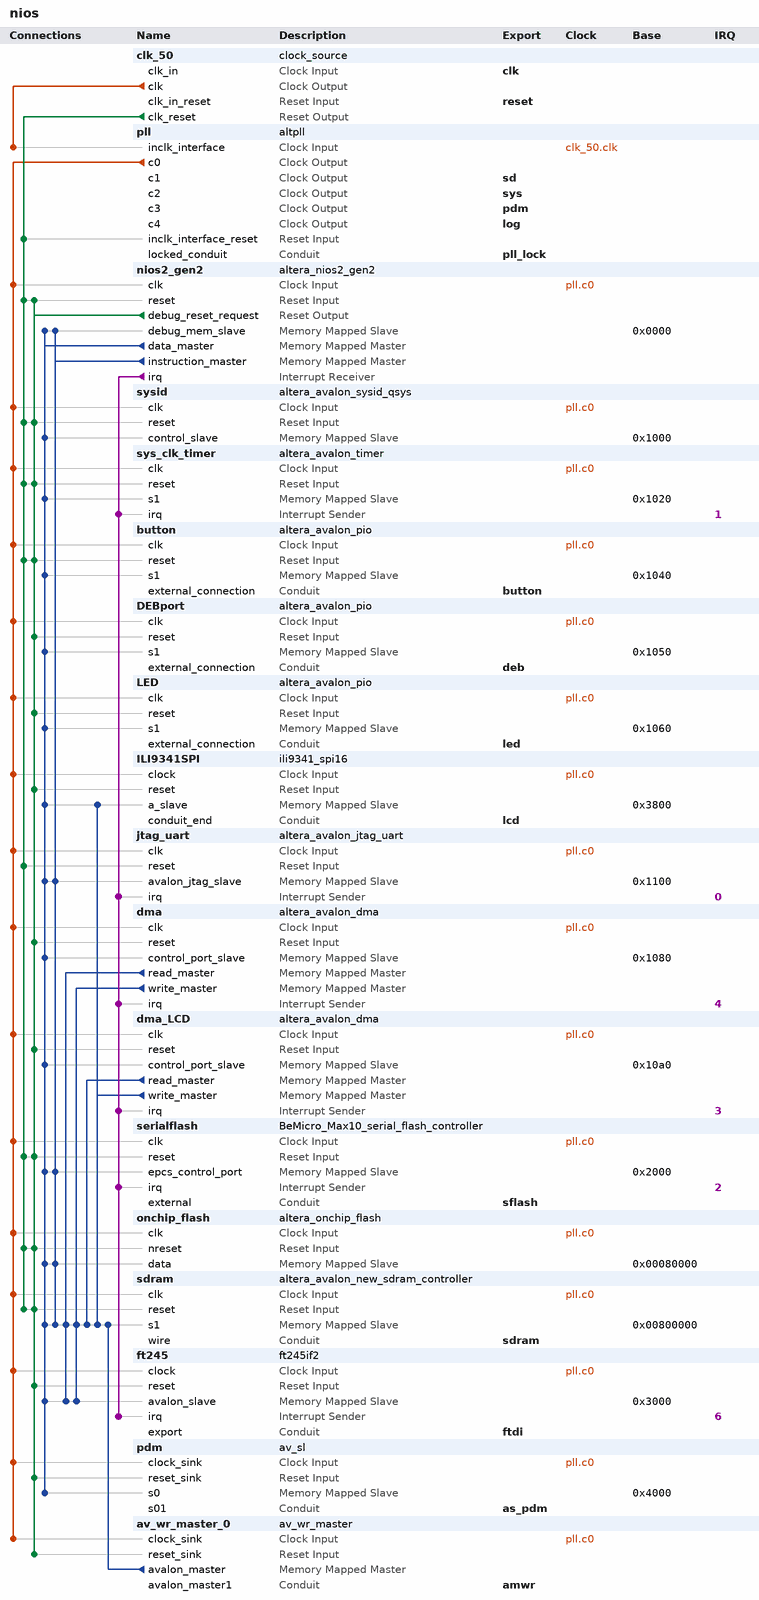
[diagram p0: system contents]
# Platform Designer (Qsys) system nios, MAX 10 10M08DAF484C8GES
# Parameters at their usual value, and those the tool derives, are not listed.
package require -exact qsys 18.1
create_system nios
set_project_property DEVICE_FAMILY {MAX 10}
set_project_property DEVICE 10M08DAF484C8GES

add_instance clk_50 clock_source 18.1
set_instance_parameter_value clk_50 clockFrequency 50000000

add_instance pll altpll 18.1
set_instance_parameter_value pll CLK0_DIVIDE_BY 1
set_instance_parameter_value pll CLK0_MULTIPLY_BY 1
set_instance_parameter_value pll CLK1_DIVIDE_BY 1
set_instance_parameter_value pll CLK1_DUTY_CYCLE 50
set_instance_parameter_value pll CLK1_MULTIPLY_BY 1
set_instance_parameter_value pll CLK1_PHASE_SHIFT -3333
set_instance_parameter_value pll CLK2_DIVIDE_BY 1
set_instance_parameter_value pll CLK2_DUTY_CYCLE 50
set_instance_parameter_value pll CLK2_MULTIPLY_BY 1
set_instance_parameter_value pll CLK2_PHASE_SHIFT 0
set_instance_parameter_value pll CLK3_DIVIDE_BY 3125
set_instance_parameter_value pll CLK3_DUTY_CYCLE 50
set_instance_parameter_value pll CLK3_MULTIPLY_BY 128
set_instance_parameter_value pll CLK3_PHASE_SHIFT 0
set_instance_parameter_value pll CLK4_DIVIDE_BY 50
set_instance_parameter_value pll CLK4_DUTY_CYCLE 50
set_instance_parameter_value pll CLK4_MULTIPLY_BY 1
set_instance_parameter_value pll CLK4_PHASE_SHIFT 0
set_instance_parameter_value pll INCLK0_INPUT_FREQUENCY 20000
set_instance_parameter_value pll PORT_ARESET PORT_UNUSED
set_instance_parameter_value pll PORT_LOCKED PORT_USED
set_instance_parameter_value pll PORT_clk1 PORT_USED
set_instance_parameter_value pll PORT_clk2 PORT_USED
set_instance_parameter_value pll PORT_clk3 PORT_USED
set_instance_parameter_value pll PORT_clk4 PORT_USED

add_instance nios2_gen2 altera_nios2_gen2 18.1
set_instance_parameter_value nios2_gen2 dcache_size 0
set_instance_parameter_value nios2_gen2 exceptionSlave sdram.s1
set_instance_parameter_value nios2_gen2 icache_size 4096
set_instance_parameter_value nios2_gen2 impl Tiny
set_instance_parameter_value nios2_gen2 io_regionsize 32768
set_instance_parameter_value nios2_gen2 resetSlave serialflash.epcs_control_port

add_instance sysid altera_avalon_sysid_qsys 18.1
set_instance_parameter_value sysid id 944587856

add_instance sys_clk_timer altera_avalon_timer 18.1
set_instance_parameter_value sys_clk_timer period 1
set_instance_parameter_value sys_clk_timer periodUnits MSEC

add_instance button altera_avalon_pio 18.1
set_instance_parameter_value button direction Input
set_instance_parameter_value button width 4

add_instance DEBport altera_avalon_pio 18.1
set_instance_parameter_value DEBport direction Output
set_instance_parameter_value DEBport width 8

add_instance LED altera_avalon_pio 18.1
set_instance_parameter_value LED direction Output
set_instance_parameter_value LED width 8

add_instance ILI9341SPI ili9341_spi16 1.0

add_instance jtag_uart altera_avalon_jtag_uart 18.1
set_instance_parameter_value jtag_uart simInteractiveOptions NO_INTERACTIVE_WINDOWS

add_instance dma altera_avalon_dma 18.1
set_instance_parameter_value dma allowByteTransactions true
set_instance_parameter_value dma allowDoubleWordTransactions true
set_instance_parameter_value dma allowHalfWordTransactions true
set_instance_parameter_value dma allowQuadWordTransactions true
set_instance_parameter_value dma burstEnable false
set_instance_parameter_value dma fifoDepth 32
set_instance_parameter_value dma maxBurstSize 128
set_instance_parameter_value dma minimumDmaTransactionRegisterWidth 16

add_instance dma_LCD altera_avalon_dma 18.1
set_instance_parameter_value dma_LCD allowByteTransactions false
set_instance_parameter_value dma_LCD allowDoubleWordTransactions false
set_instance_parameter_value dma_LCD allowHalfWordTransactions true
set_instance_parameter_value dma_LCD allowQuadWordTransactions false
set_instance_parameter_value dma_LCD allowWordTransactions false
set_instance_parameter_value dma_LCD burstEnable false
set_instance_parameter_value dma_LCD fifoDepth 32
set_instance_parameter_value dma_LCD maxBurstSize 128
set_instance_parameter_value dma_LCD minimumDmaTransactionRegisterWidth 18

add_instance serialflash BeMicro_Max10_serial_flash_controller 14.0
set_instance_parameter_value serialflash autoSelectASMIAtom false
set_instance_parameter_value serialflash resetrequest_enabled true
set_instance_parameter_value serialflash useASMIAtom false

add_instance onchip_flash altera_onchip_flash 18.1
set_instance_parameter_value onchip_flash CONFIGURATION_MODE {Single Uncompressed Image with Memory Initialization}
set_instance_parameter_value onchip_flash SECTOR_ACCESS_MODE {Read and write,Read and write,Hidden,Hidden,Hidden}
set_instance_parameter_value onchip_flash initFlashContent false
set_instance_parameter_value onchip_flash initializationFileName altera_onchip_flash.hex
set_instance_parameter_value onchip_flash useNonDefaultInitFile false

add_instance sdram altera_avalon_new_sdram_controller 18.1
set_instance_parameter_value sdram TAC 5.4
set_instance_parameter_value sdram TRCD 15.0
set_instance_parameter_value sdram TRP 15.0
set_instance_parameter_value sdram casLatency 2
set_instance_parameter_value sdram columnWidth 8
set_instance_parameter_value sdram dataWidth 16
set_instance_parameter_value sdram generateSimulationModel false
set_instance_parameter_value sdram model single_Micron_MT48LC4M32B2_7_chip
set_instance_parameter_value sdram numberOfBanks 4
set_instance_parameter_value sdram numberOfChipSelects 1
set_instance_parameter_value sdram powerUpDelay 100.0
set_instance_parameter_value sdram refreshPeriod 15.625
set_instance_parameter_value sdram rowWidth 12

add_instance ft245 ft245if2 1.0

add_instance pdm av_sl 1.0

add_instance av_wr_master_0 av_wr_master 1.0

# connections
add_connection clk_50.clk pll.inclk_interface clock
add_connection pll.c0 av_wr_master_0.clock_sink clock
add_connection pll.c0 button.clk clock
add_connection pll.c0 DEBport.clk clock
add_connection pll.c0 dma.clk clock
add_connection pll.c0 dma_LCD.clk clock
add_connection pll.c0 ft245.clock clock
add_connection pll.c0 ILI9341SPI.clock clock
add_connection pll.c0 jtag_uart.clk clock
add_connection pll.c0 LED.clk clock
add_connection pll.c0 nios2_gen2.clk clock
add_connection pll.c0 onchip_flash.clk clock
add_connection pll.c0 pdm.clock_sink clock
add_connection pll.c0 sdram.clk clock
add_connection pll.c0 serialflash.clk clock
add_connection pll.c0 sys_clk_timer.clk clock
add_connection pll.c0 sysid.clk clock
add_connection clk_50.clk_reset button.reset reset
add_connection clk_50.clk_reset jtag_uart.reset reset
add_connection clk_50.clk_reset nios2_gen2.reset reset
add_connection clk_50.clk_reset onchip_flash.nreset reset
add_connection clk_50.clk_reset pll.inclk_interface_reset reset
add_connection clk_50.clk_reset sdram.reset reset
add_connection clk_50.clk_reset serialflash.reset reset
add_connection clk_50.clk_reset sys_clk_timer.reset reset
add_connection clk_50.clk_reset sysid.reset reset
add_connection nios2_gen2.debug_reset_request av_wr_master_0.reset_sink reset
add_connection nios2_gen2.debug_reset_request button.reset reset
add_connection nios2_gen2.debug_reset_request DEBport.reset reset
add_connection nios2_gen2.debug_reset_request dma.reset reset
add_connection nios2_gen2.debug_reset_request dma_LCD.reset reset
add_connection nios2_gen2.debug_reset_request ft245.reset reset
add_connection nios2_gen2.debug_reset_request ILI9341SPI.reset reset
add_connection nios2_gen2.debug_reset_request LED.reset reset
add_connection nios2_gen2.debug_reset_request nios2_gen2.reset reset
add_connection nios2_gen2.debug_reset_request onchip_flash.nreset reset
add_connection nios2_gen2.debug_reset_request pdm.reset_sink reset
add_connection nios2_gen2.debug_reset_request sdram.reset reset
add_connection nios2_gen2.debug_reset_request serialflash.reset reset
add_connection nios2_gen2.debug_reset_request sys_clk_timer.reset reset
add_connection nios2_gen2.debug_reset_request sysid.reset reset
add_connection av_wr_master_0.avalon_master sdram.s1 avalon
set_connection_parameter_value av_wr_master_0.avalon_master/sdram.s1 baseAddress 0x00800000
add_connection dma.read_master ft245.avalon_slave avalon
set_connection_parameter_value dma.read_master/ft245.avalon_slave baseAddress 0x3000
add_connection dma.read_master sdram.s1 avalon
set_connection_parameter_value dma.read_master/sdram.s1 baseAddress 0x00800000
add_connection dma.write_master ft245.avalon_slave avalon
set_connection_parameter_value dma.write_master/ft245.avalon_slave baseAddress 0x3000
add_connection dma.write_master sdram.s1 avalon
set_connection_parameter_value dma.write_master/sdram.s1 baseAddress 0x00800000
add_connection dma_LCD.read_master sdram.s1 avalon
set_connection_parameter_value dma_LCD.read_master/sdram.s1 baseAddress 0x00800000
add_connection dma_LCD.write_master ILI9341SPI.a_slave avalon
set_connection_parameter_value dma_LCD.write_master/ILI9341SPI.a_slave baseAddress 0x3800
add_connection dma_LCD.write_master sdram.s1 avalon
set_connection_parameter_value dma_LCD.write_master/sdram.s1 baseAddress 0x00800000
add_connection nios2_gen2.data_master button.s1 avalon
set_connection_parameter_value nios2_gen2.data_master/button.s1 baseAddress 0x1040
add_connection nios2_gen2.data_master DEBport.s1 avalon
set_connection_parameter_value nios2_gen2.data_master/DEBport.s1 baseAddress 0x1050
add_connection nios2_gen2.data_master dma.control_port_slave avalon
set_connection_parameter_value nios2_gen2.data_master/dma.control_port_slave baseAddress 0x1080
add_connection nios2_gen2.data_master dma_LCD.control_port_slave avalon
set_connection_parameter_value nios2_gen2.data_master/dma_LCD.control_port_slave baseAddress 0x10a0
add_connection nios2_gen2.data_master ft245.avalon_slave avalon
set_connection_parameter_value nios2_gen2.data_master/ft245.avalon_slave baseAddress 0x3000
add_connection nios2_gen2.data_master ILI9341SPI.a_slave avalon
set_connection_parameter_value nios2_gen2.data_master/ILI9341SPI.a_slave baseAddress 0x3800
add_connection nios2_gen2.data_master jtag_uart.avalon_jtag_slave avalon
set_connection_parameter_value nios2_gen2.data_master/jtag_uart.avalon_jtag_slave baseAddress 0x1100
add_connection nios2_gen2.data_master LED.s1 avalon
set_connection_parameter_value nios2_gen2.data_master/LED.s1 baseAddress 0x1060
add_connection nios2_gen2.data_master nios2_gen2.debug_mem_slave avalon
set_connection_parameter_value nios2_gen2.data_master/nios2_gen2.debug_mem_slave baseAddress 0x0000
add_connection nios2_gen2.data_master onchip_flash.data avalon
set_connection_parameter_value nios2_gen2.data_master/onchip_flash.data baseAddress 0x00080000
add_connection nios2_gen2.data_master pdm.s0 avalon
set_connection_parameter_value nios2_gen2.data_master/pdm.s0 baseAddress 0x4000
add_connection nios2_gen2.data_master sdram.s1 avalon
set_connection_parameter_value nios2_gen2.data_master/sdram.s1 baseAddress 0x00800000
add_connection nios2_gen2.data_master serialflash.epcs_control_port avalon
set_connection_parameter_value nios2_gen2.data_master/serialflash.epcs_control_port baseAddress 0x2000
add_connection nios2_gen2.data_master sys_clk_timer.s1 avalon
set_connection_parameter_value nios2_gen2.data_master/sys_clk_timer.s1 baseAddress 0x1020
add_connection nios2_gen2.data_master sysid.control_slave avalon
set_connection_parameter_value nios2_gen2.data_master/sysid.control_slave baseAddress 0x1000
add_connection nios2_gen2.instruction_master jtag_uart.avalon_jtag_slave avalon
set_connection_parameter_value nios2_gen2.instruction_master/jtag_uart.avalon_jtag_slave baseAddress 0x1100
add_connection nios2_gen2.instruction_master nios2_gen2.debug_mem_slave avalon
set_connection_parameter_value nios2_gen2.instruction_master/nios2_gen2.debug_mem_slave baseAddress 0x0000
add_connection nios2_gen2.instruction_master onchip_flash.data avalon
set_connection_parameter_value nios2_gen2.instruction_master/onchip_flash.data baseAddress 0x00080000
add_connection nios2_gen2.instruction_master sdram.s1 avalon
set_connection_parameter_value nios2_gen2.instruction_master/sdram.s1 baseAddress 0x00800000
add_connection nios2_gen2.instruction_master serialflash.epcs_control_port avalon
set_connection_parameter_value nios2_gen2.instruction_master/serialflash.epcs_control_port baseAddress 0x2000
add_connection nios2_gen2.irq dma.irq interrupt
set_connection_parameter_value nios2_gen2.irq/dma.irq irqNumber 4
add_connection nios2_gen2.irq dma_LCD.irq interrupt
set_connection_parameter_value nios2_gen2.irq/dma_LCD.irq irqNumber 3
add_connection nios2_gen2.irq ft245.irq interrupt
set_connection_parameter_value nios2_gen2.irq/ft245.irq irqNumber 6
add_connection nios2_gen2.irq jtag_uart.irq interrupt
set_connection_parameter_value nios2_gen2.irq/jtag_uart.irq irqNumber 0
add_connection nios2_gen2.irq serialflash.irq interrupt
set_connection_parameter_value nios2_gen2.irq/serialflash.irq irqNumber 2
add_connection nios2_gen2.irq sys_clk_timer.irq interrupt
set_connection_parameter_value nios2_gen2.irq/sys_clk_timer.irq irqNumber 1

# exported interfaces
add_interface amwr conduit end
set_interface_property amwr EXPORT_OF av_wr_master_0.avalon_master1
add_interface as_pdm conduit end
set_interface_property as_pdm EXPORT_OF pdm.s01
add_interface button conduit end
set_interface_property button EXPORT_OF button.external_connection
add_interface clk clock sink
set_interface_property clk EXPORT_OF clk_50.clk_in
add_interface deb conduit end
set_interface_property deb EXPORT_OF DEBport.external_connection
add_interface ftdi conduit end
set_interface_property ftdi EXPORT_OF ft245.export
add_interface lcd conduit end
set_interface_property lcd EXPORT_OF ILI9341SPI.conduit_end
add_interface led conduit end
set_interface_property led EXPORT_OF LED.external_connection
add_interface log clock source
set_interface_property log EXPORT_OF pll.c4
add_interface pdm clock source
set_interface_property pdm EXPORT_OF pll.c3
add_interface pll_lock conduit end
set_interface_property pll_lock EXPORT_OF pll.locked_conduit
add_interface reset reset sink
set_interface_property reset EXPORT_OF clk_50.clk_in_reset
add_interface sd clock source
set_interface_property sd EXPORT_OF pll.c1
add_interface sdram conduit end
set_interface_property sdram EXPORT_OF sdram.wire
add_interface sflash conduit end
set_interface_property sflash EXPORT_OF serialflash.external
add_interface sys clock source
set_interface_property sys EXPORT_OF pll.c2

set_interconnect_requirement {$system} qsys_mm.clockCrossingAdapter HANDSHAKE
set_interconnect_requirement {$system} qsys_mm.insertDefaultSlave FALSE
set_interconnect_requirement {$system} qsys_mm.maxAdditionalLatency 1

save_system nios.qsys
